# Altium schematic sheet Banks.SchDoc
size A3; SheetNumber: 4; SheetTotal: 5
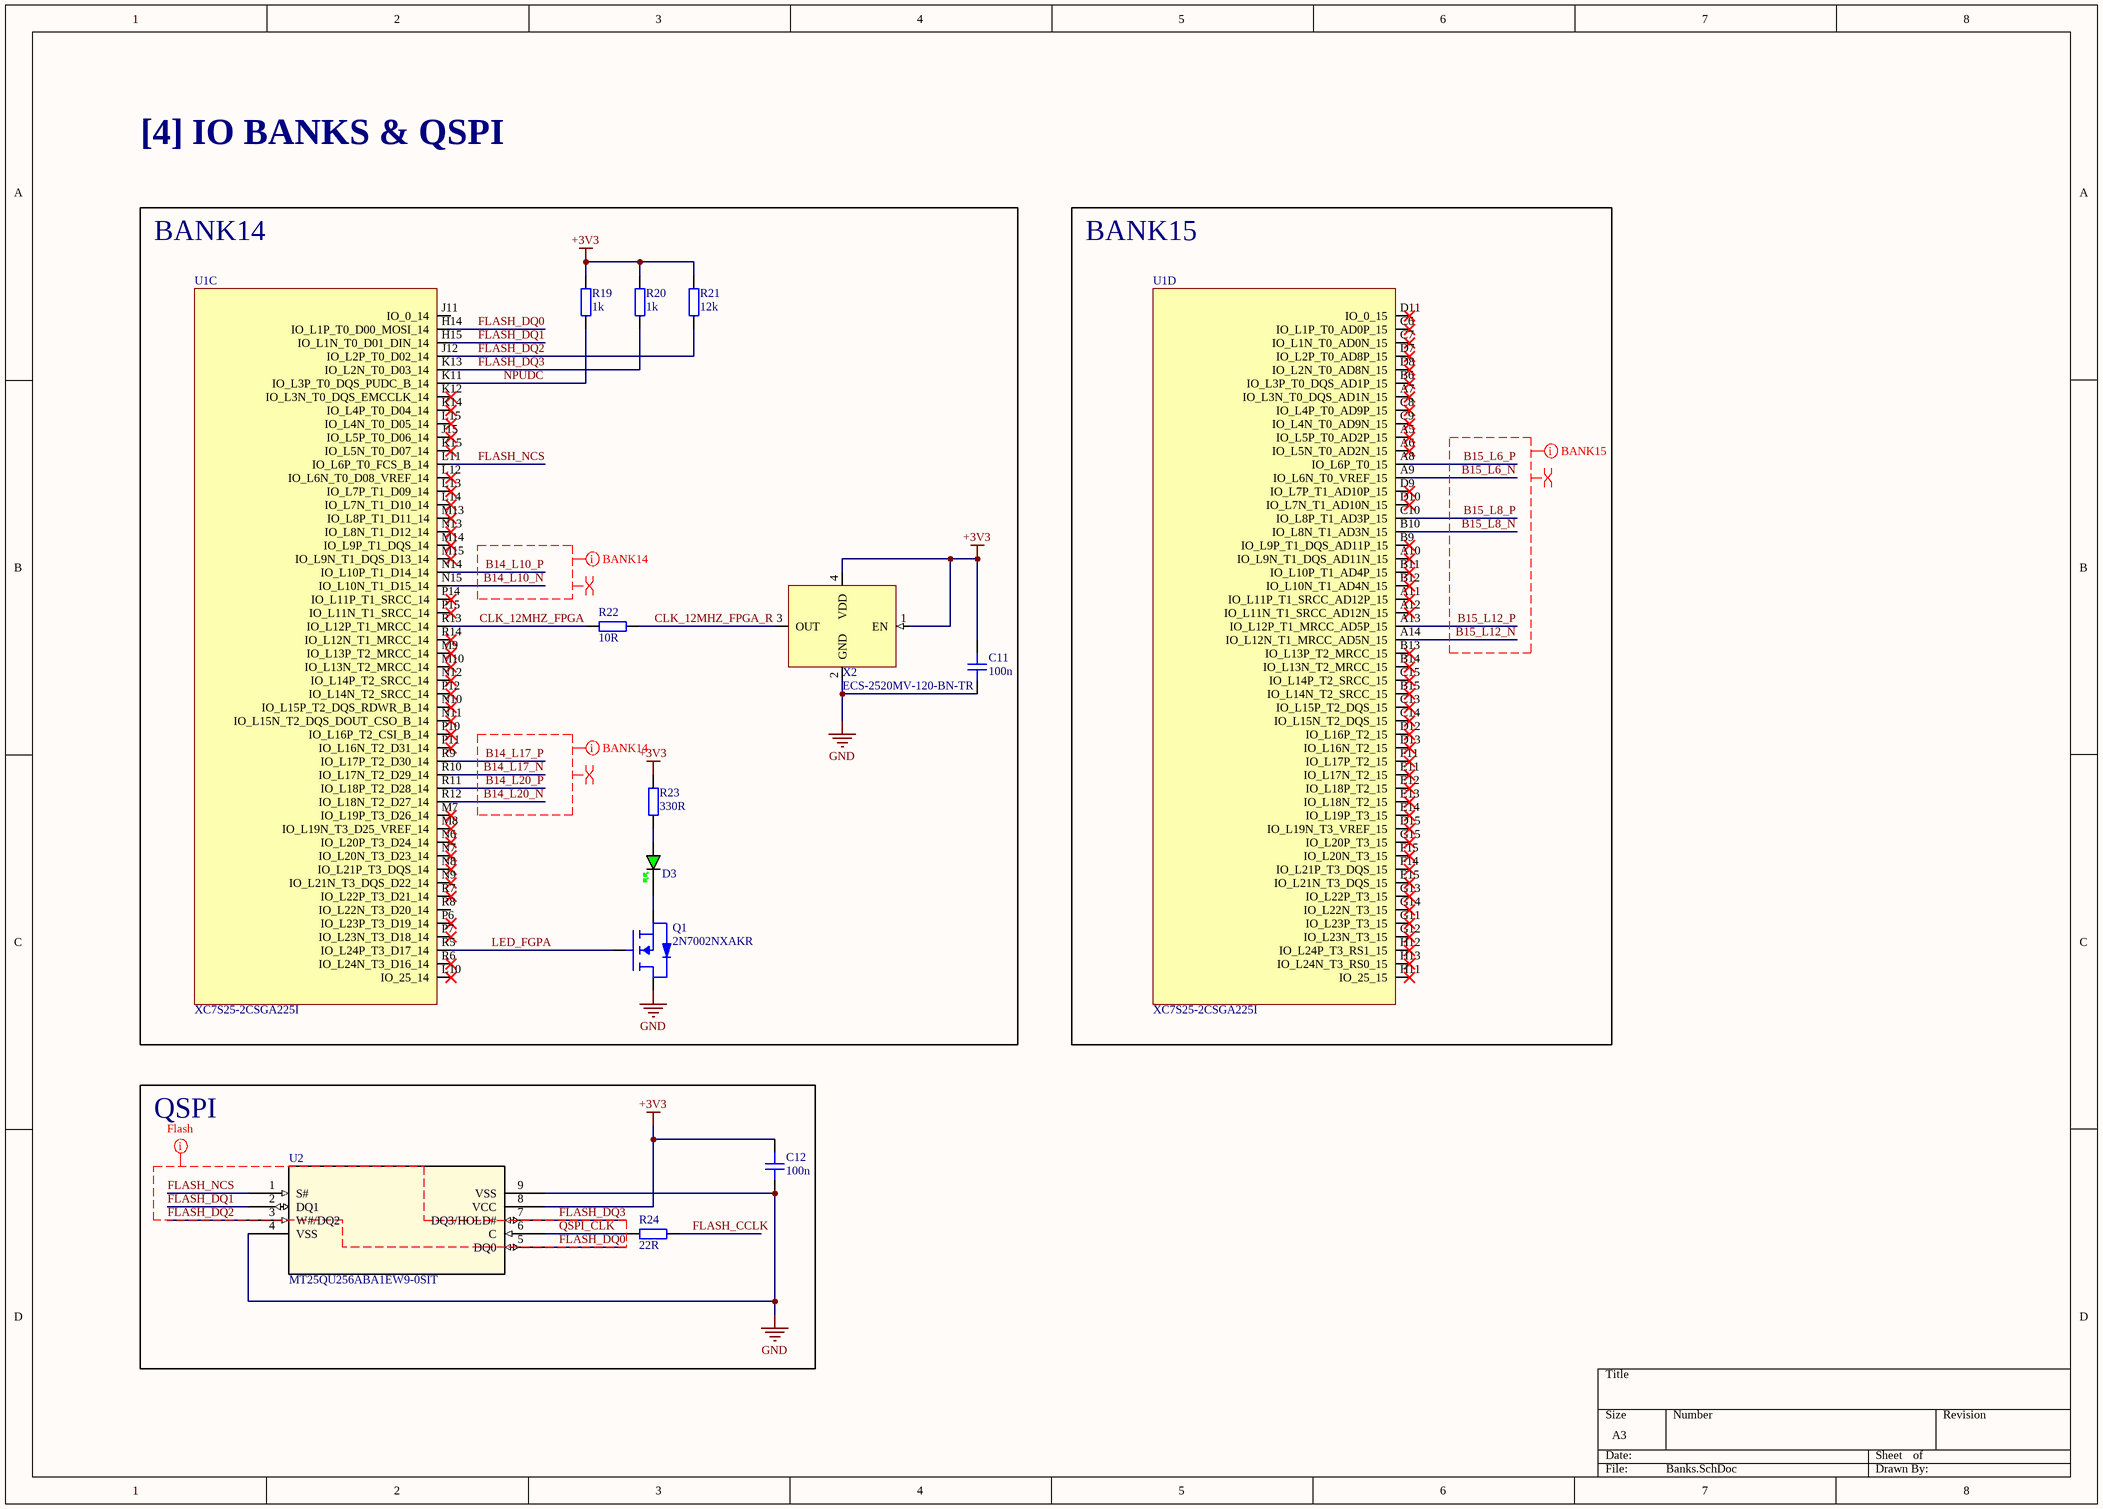
[diagram p0: Banks.SchDoc]

## Parts
C11  100n  [CAP_0402]
C12  100n  [CAP_0402]
D3  GREEN  [LED_0402_GREEN]  (value not drawn)
Q1  2N7002NXAKR  [SSM3J338R,LF-SOT23-F]
R19  1k  [RES_0201]
R20  1k  [RES_0201]
R21  12k  [RES_0201]
R22  10R  [RES_0402]
R23  330R  [RES_0402]
R24  22R  [RES_0402]
U1  XC7S25-2CSGA225I  [CSGA225]  (parts C,D of 5)
U2  MT25QU256ABA1EW9-0SIT  [W-PDFN-8MLP8_8X6_MRN]
X2  ECS-2520MV-120-BN-TR  [XTAL_2520]

## Blocks framed on the sheet
BANK14: C11 D3 Q1 R19-R23 U1 X2
BANK15: U1
QSPI: C12 R24 U2

## Nets
+3V3: C11.2 C12.2 R19.2 R20.2 R21.2 R23.2 U2.8(VCC) X2.1(EN) X2.4(VDD)
GND: C11.1 C12.1 Q1.D U2.4(VSS) U2.9(VSS) X2.2(GND)
B14_L10_N: U1.N15(IO_L10N_T1_D15_14)
B14_L10_P: U1.N14(IO_L10P_T1_D14_14)
B14_L17_N: U1.R10(IO_L17N_T2_D29_14)
B14_L17_P: U1.R9(IO_L17P_T2_D30_14)
B14_L20_N: U1.R12(IO_L18N_T2_D27_14)
B14_L20_P: U1.R11(IO_L18P_T2_D28_14)
B15_L6_N: U1.A9(IO_L6N_T0_VREF_15)
B15_L6_P: U1.A8(IO_L6P_T0_15)
B15_L8_N: U1.B10(IO_L8N_T1_AD3N_15)
B15_L8_P: U1.C10(IO_L8P_T1_AD3P_15)
B15_L12_N: U1.A14(IO_L12N_T1_MRCC_AD5N_15)
B15_L12_P: U1.A13(IO_L12P_T1_MRCC_AD5P_15)
CLK_12MHZ_FPGA: R22.2 U1.R13(IO_L12P_T1_MRCC_14)
CLK_12MHZ_FPGA_R: R22.1 X2.3(OUT)
FLASH_CCLK: R24.2
FLASH_DQ0: U1.H14(IO_L1P_T0_D00_MOSI_14) U2.5(DQ0)
FLASH_DQ1: U1.H15(IO_L1N_T0_D01_DIN_14) U2.2(DQ1)
FLASH_DQ2: R21.1 U1.J12(IO_L2P_T0_D02_14) U2.3(W#/DQ2)
FLASH_DQ3: R20.1 U1.K13(IO_L2N_T0_D03_14) U2.7(DQ3/HOLD#)
FLASH_NCS: U1.L11(IO_L6P_T0_FCS_B_14) U2.1(S#)
LED_FGPA: Q1.G U1.R5(IO_L24P_T3_D17_14)
NPUDC: R19.1 U1.K11(IO_L3P_T0_DQS_PUDC_B_14)
QSPI_CLK: R24.1 U2.6(C)
NetD3_A: D3.A R23.1
NetD3_K: D3.K Q1.S

Not connected (* = marked no-connect by the designer): U1 A5(IO_L5P_T0_AD2P_15)* A6(IO_L5N_T0_AD2N_15)* A7(IO_L3N_T0_DQS_AD1N_15)* A10(IO_L9N_T1_DQS_AD11N_15)* A11(IO_L11P_T1_SRCC_AD12P_15)* A12(IO_L11N_T1_SRCC_AD12N_15)* B6(IO_L3P_T0_DQS_AD1P_15)* B9(IO_L9P_T1_DQS_AD11P_15)* B11(IO_L10P_T1_AD4P_15)* B12(IO_L10N_T1_AD4N_15)* B13(IO_L13P_T2_MRCC_15)* B14(IO_L13N_T2_MRCC_15)* B15(IO_L14N_T2_SRCC_15)* C6(IO_L1P_T0_AD0P_15)* C7(IO_L1N_T0_AD0N_15)* C8(IO_L4P_T0_AD9P_15)* C9(IO_L4N_T0_AD9N_15)* C13(IO_L15P_T2_DQS_15)* C14(IO_L15N_T2_DQS_15)* C15(IO_L14P_T2_SRCC_15)* D7(IO_L2P_T0_AD8P_15)* D8(IO_L2N_T0_AD8N_15)* D9(IO_L7P_T1_AD10P_15)* D10(IO_L7N_T1_AD10N_15)* D11(IO_0_15)* D12(IO_L16P_T2_15)* D13(IO_L16N_T2_15)* D15(IO_L19N_T3_VREF_15)* E11(IO_L17N_T2_15)* E12(IO_L18P_T2_15)* E13(IO_L18N_T2_15)* E14(IO_L19P_T3_15)* E15(IO_L21N_T3_DQS_15)* F11(IO_L17P_T2_15)* F14(IO_L21P_T3_DQS_15)* F15(IO_L20N_T3_15)* G11(IO_L23P_T3_15)* G12(IO_L23N_T3_15)* G13(IO_L22P_T3_15)* G14(IO_L22N_T3_15)* G15(IO_L20P_T3_15)* H11(IO_25_15)* H12(IO_L24P_T3_RS1_15)* H13(IO_L24N_T3_RS0_15)* J11(IO_0_14) J15(IO_L5P_T0_D06_14)* K12(IO_L3N_T0_DQS_EMCCLK_14)* K14(IO_L4P_T0_D04_14)* K15(IO_L5N_T0_D07_14)* L10(IO_25_14)* L12(IO_L6N_T0_D08_VREF_14)* L13(IO_L7P_T1_D09_14)* L14(IO_L7N_T1_D10_14)* L15(IO_L4N_T0_D05_14)* M7(IO_L19P_T3_D26_14)* M8(IO_L19N_T3_D25_VREF_14)* M9(IO_L13P_T2_MRCC_14)* M10(IO_L13N_T2_MRCC_14)* M13(IO_L8P_T1_D11_14)* M14(IO_L9P_T1_DQS_14)* M15(IO_L9N_T1_DQS_D13_14)* N6(IO_L20P_T3_D24_14)* N7(IO_L20N_T3_D23_14)* N8(IO_L21P_T3_DQS_14)* N9(IO_L21N_T3_DQS_D22_14)* N10(IO_L15P_T2_DQS_RDWR_B_14)* N11(IO_L15N_T2_DQS_DOUT_CSO_B_14)* N12(IO_L14P_T2_SRCC_14)* N13(IO_L8N_T1_D12_14)* P6(IO_L23P_T3_D19_14)* P7(IO_L23N_T3_D18_14)* P10(IO_L16P_T2_CSI_B_14)* P11(IO_L16N_T2_D31_14)* P12(IO_L14N_T2_SRCC_14)* P14(IO_L11P_T1_SRCC_14)* P15(IO_L11N_T1_SRCC_14)* R6(IO_L24N_T3_D16_14)* R7(IO_L22P_T3_D21_14)* R8(IO_L22N_T3_D20_14) R14(IO_L12N_T1_MRCC_14)*

## Layout directives
mark named Flash: FLASH_DQ0, FLASH_DQ1, FLASH_DQ2, FLASH_DQ3, FLASH_NCS, QSPI_CLK
differential pair: B14_L10_N, B14_L10_P, B14_L17_N, B14_L17_P, B14_L20_N, B14_L20_P, B15_L6_N, B15_L6_P, B15_L8_N, B15_L8_P, B15_L12_N, B15_L12_P
net class B_14; rule Matched Net Lengths [Delay Tolerance = 50ps]: B14_L17_N, B14_L17_P, B14_L20_N, B14_L20_P
rule Matched Net Lengths [Delay Tolerance = 50ps]; net class B_15: B15_L6_N, B15_L6_P, B15_L8_N, B15_L8_P, B15_L12_N, B15_L12_P
rule Matched Net Lengths [Delay Tolerance = 50ps]; net class B_14: B14_L10_N, B14_L10_P

## Notes on the sheet
- [4] IO BANKS & QSPI

## Library data of the parts
C11 C12 = CAP_0402: Capacitor SMD 0402; Manufacturer: *; Manufacturer Part Number: *; Distributor Link: *; LCSC: *; Rating: *; Dielectric: *
D3 = LED_0402_GREEN: LED 0402 GREEN SMD
Q1 = 2N7002NXAKR: MOSFET N-Channel Vds=60V Id=300mA with ESD Protection; Manufacturer: Nexperia; Manufacturer Part Number: 2N7002NXAKR
R19-R21 = RES_0201: Resistor SMD 0201; Manufacturer: *; Manufacturer Part Number: *; Distributor Link: *; LCSC: *
R22-R24 = RES_0402: Resistor SMD 0402; Manufacturer: *; Manufacturer Part Number: *; Distributor Link: *; LCSC: *
U1 = XC7S25-2CSGA225I: Field-Programmable Gate Array FPGA Spartan-7 Series CSGA-225 Speed Grade 2 Industrial Temperature Range; Manufacturer: Xilinx; Manufacturer Part Number: XC7S25-2CSGA225I; Distributor Link: https://www.lcsc.com/product-detail/Programmable-Logic-Device-CPLDs-FPGAs_XILINX-XC7S25-2CSGA225I_C1521711.html; LCSC: C1521711
U2 = MT25QU256ABA1EW9-0SIT: No Description Available; Mfr_Name: Micron; RefDes: RefDes; Type: Type
X2 = ECS-2520MV-130-BN-TR: Standard Clock Oscillators XO (Standard),13MHz,Standby (Power Down),CMOS, Multi-Volt,1.6 V 3.6 V,+/-50ppm,-40 C 85 C,6mA,Surface Mount,4-SMD, No Lead,(2.50mm x 2.00mm),(0.80mm); Manufacturer: ECS; Manufacturer Part Number: ECS-2520MV-130-BN-TR